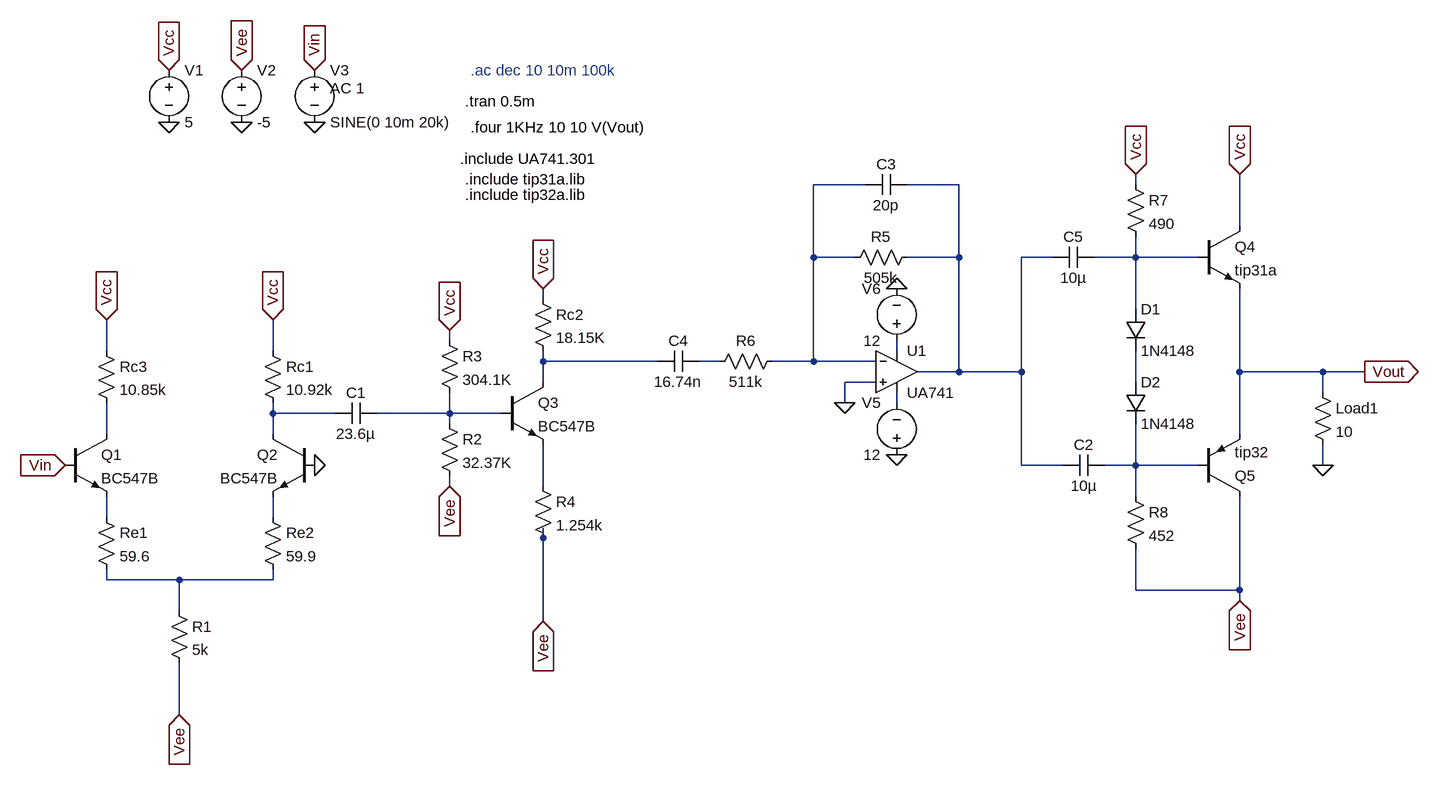
[diagram p0: schematic hardware_sim.asc]
hardware_sim.asc, the LTspice schematic file:
Version 4
SHEET 1 1568 872
WIRE 688 -64 608 -64
WIRE 832 -64 752 -64
WIRE 1104 -64 1104 -80
WIRE 1264 0 1264 -80
WIRE 608 48 608 -64
WIRE 672 48 608 48
WIRE 832 48 832 -64
WIRE 832 48 752 48
WIRE 976 48 928 48
WIRE 1104 48 1104 16
WIRE 1104 48 1040 48
WIRE 1200 48 1104 48
WIRE 192 112 192 96
WIRE 1104 128 1104 48
WIRE 48 176 48 160
WIRE -480 192 -480 144
WIRE -224 192 -224 144
WIRE 736 192 736 176
WIRE 192 208 192 192
WIRE 368 208 192 208
WIRE 464 208 432 208
WIRE 608 208 608 48
WIRE 608 208 544 208
WIRE 704 208 608 208
WIRE 832 224 832 48
WIRE 832 224 768 224
WIRE 928 224 928 48
WIRE 928 224 832 224
WIRE 1264 224 1264 96
WIRE 1392 224 1264 224
WIRE 1456 224 1392 224
WIRE 192 240 192 208
WIRE 704 240 656 240
WIRE 1104 240 1104 192
WIRE 1392 256 1392 224
WIRE 656 272 656 240
WIRE 736 272 736 256
WIRE -224 288 -224 272
WIRE -128 288 -224 288
WIRE 48 288 48 256
WIRE 48 288 -64 288
WIRE 128 288 48 288
WIRE 48 304 48 288
WIRE -480 320 -480 272
WIRE -224 320 -224 288
WIRE 1264 320 1264 224
WIRE 928 368 928 224
WIRE 992 368 928 368
WIRE 1104 368 1104 304
WIRE 1104 368 1056 368
WIRE 1200 368 1104 368
WIRE 1392 368 1392 336
WIRE 48 400 48 384
WIRE 192 400 192 336
WIRE 1104 416 1104 368
WIRE -480 448 -480 416
WIRE -224 448 -224 416
WIRE 192 480 192 464
WIRE -480 544 -480 528
WIRE -368 544 -480 544
WIRE -224 544 -224 528
WIRE -224 544 -368 544
WIRE 1104 560 1104 496
WIRE 1264 560 1264 416
WIRE 1264 560 1104 560
WIRE 1264 576 1264 560
WIRE -368 592 -368 544
WIRE 192 608 192 480
WIRE -368 752 -368 672
FLAG -384 -160 0
FLAG -272 -160 0
FLAG -384 -240 Vcc
IOPIN -384 -240 In
FLAG -272 -240 Vee
IOPIN -272 -240 In
FLAG -368 752 Vee
IOPIN -368 752 In
FLAG -224 144 Vcc
IOPIN -224 144 In
FLAG -480 144 Vcc
IOPIN -480 144 In
FLAG -160 -160 0
FLAG -160 -240 Vin
IOPIN -160 -240 In
FLAG -544 368 Vin
IOPIN -544 368 In
FLAG -160 368 0
FLAG 48 160 Vcc
IOPIN 48 160 In
FLAG 192 96 Vcc
IOPIN 192 96 In
FLAG 48 400 Vee
IOPIN 48 400 In
FLAG 192 608 Vee
IOPIN 192 608 In
FLAG 656 272 0
FLAG 736 352 0
FLAG 736 96 0
FLAG 1456 224 Vout
IOPIN 1456 224 Out
FLAG 1264 -80 Vcc
IOPIN 1264 -80 In
FLAG 1104 -80 Vcc
IOPIN 1104 -80 In
FLAG 1392 368 0
FLAG 1264 576 Vee
IOPIN 1264 576 In
DATAFLAG -224 288 ""
DATAFLAG -368 544 ""
DATAFLAG 1120 48 ""
DATAFLAG 1120 368 ""
DATAFLAG 1264 224 ""
SYMBOL npn -544 320 R0
SYMATTR InstName Q1
SYMATTR Value BC547B
SYMBOL npn -160 320 M0
SYMATTR InstName Q2
SYMATTR Value BC547B
SYMBOL voltage -384 -256 R0
WINDOW 123 0 0 Left 0
WINDOW 39 0 0 Left 0
SYMATTR InstName V1
SYMATTR Value 5
SYMBOL voltage -272 -256 R0
WINDOW 123 0 0 Left 0
WINDOW 39 0 0 Left 0
SYMATTR InstName V2
SYMATTR Value -5
SYMBOL res -384 576 R0
SYMATTR InstName R1
SYMATTR Value 5k
SYMBOL res -240 176 R0
SYMATTR InstName Rc1
SYMATTR Value 10.92k
SYMBOL cap -64 272 R90
WINDOW 0 0 32 VBottom 2
WINDOW 3 32 32 VTop 2
SYMATTR InstName C1
SYMATTR Value 23.6µ
SYMBOL voltage -160 -256 R0
WINDOW 123 24 44 Left 2
WINDOW 39 0 0 Left 0
SYMATTR Value2 AC 1
SYMATTR InstName V3
SYMATTR Value SINE(0 10m 20k)
SYMBOL res -496 176 R0
SYMATTR InstName Rc3
SYMATTR Value 10.85k
SYMBOL res -496 432 R0
SYMATTR InstName Re1
SYMATTR Value 59.6
SYMBOL res -240 432 R0
SYMATTR InstName Re2
SYMATTR Value 59.9
SYMBOL res 32 288 R0
SYMATTR InstName R2
SYMATTR Value 32.37K
SYMBOL res 32 160 R0
SYMATTR InstName R3
SYMATTR Value 304.1K
SYMBOL res 176 96 R0
SYMATTR InstName Rc2
SYMATTR Value 18.15K
SYMBOL npn 128 240 R0
SYMATTR InstName Q3
SYMATTR Value BC547B
SYMBOL res 176 384 R0
SYMATTR InstName R4
SYMATTR Value 1.254k
SYMBOL OpAmps\\opamp2 736 160 R0
SYMATTR InstName U1
SYMATTR Value UA741
SYMBOL cap 752 -80 R90
WINDOW 0 0 32 VBottom 2
WINDOW 3 32 32 VTop 2
SYMATTR InstName C3
SYMATTR Value 20p
SYMBOL res 768 32 R90
WINDOW 0 0 56 VBottom 2
WINDOW 3 32 56 VTop 2
SYMATTR InstName R5
SYMATTR Value 505k
SYMBOL res 560 192 R90
WINDOW 0 0 56 VBottom 2
WINDOW 3 32 56 VTop 2
SYMATTR InstName R6
SYMATTR Value 511k
SYMBOL cap 432 192 R90
WINDOW 0 0 32 VBottom 2
WINDOW 3 32 32 VTop 2
SYMATTR InstName C4
SYMATTR Value 16.74n
SYMBOL voltage 736 368 R180
WINDOW 0 24 96 Left 2
WINDOW 3 24 16 Left 2
WINDOW 123 0 0 Left 0
WINDOW 39 0 0 Left 0
SYMATTR InstName V5
SYMATTR Value 12
SYMBOL voltage 736 192 R180
WINDOW 0 24 96 Left 2
WINDOW 3 24 16 Left 2
WINDOW 123 0 0 Left 0
WINDOW 39 0 0 Left 0
SYMATTR InstName V6
SYMATTR Value 12
SYMBOL diode 1088 128 R0
SYMATTR InstName D1
SYMATTR Value 1N4148
SYMBOL diode 1088 240 R0
SYMATTR InstName D2
SYMATTR Value 1N4148
SYMBOL res 1088 -80 R0
SYMATTR InstName R7
SYMATTR Value 490
SYMBOL res 1088 400 R0
SYMATTR InstName R8
SYMATTR Value 452
SYMBOL res 1376 240 R0
SYMATTR InstName Load1
SYMATTR Value 10
SYMBOL cap 1056 352 R90
WINDOW 0 0 32 VBottom 2
WINDOW 3 32 32 VTop 2
SYMATTR InstName C2
SYMATTR Value 10µ
SYMBOL cap 1040 32 R90
WINDOW 0 0 32 VBottom 2
WINDOW 3 32 32 VTop 2
SYMATTR InstName C5
SYMATTR Value 10µ
SYMBOL npn 1200 0 R0
SYMATTR InstName Q4
SYMATTR Value tip31a
SYMBOL pnp 1200 416 M180
SYMATTR InstName Q5
SYMATTR Value tip32
TEXT 64 -104 Left 2 !.include UA741.301
TEXT 80 -152 Left 2 !.four 1KHz 10 10 V(Vout)
TEXT 72 -192 Left 2 !.tran 0.5m
TEXT 72 -72 Left 2 !.include tip31a.lib
TEXT 72 -48 Left 2 !.include tip32a.lib
TEXT 80 -240 Left 2 ;.ac dec 10 10m 100k

The netlist it stands for:
* hardware_sim.asc
Q1 N011 Vin N014 0 BC547B
Q2 N009 0 N015 0 BC547B
V1 Vcc 0 5
V2 Vee 0 -5
R1 N016 Vee 5k
Rc1 Vcc N009 10.92k
C1 N010 N009 23.6µ
V3 Vin 0 SINE(0 10m 20k) AC 1
Rc3 Vcc N011 10.85k
Re1 N014 N016 59.6
Re2 N015 N016 59.9
R2 N010 Vee 32.37K
R3 Vcc N010 304.1K
Rc2 Vcc N005 18.15K
Q3 N005 N010 N013 0 BC547B
R4 N013 Vee 1.254k
XU1 0 N001 N004 N008 N002 UA741  ; pins In+ In- V+ V- OUT
C3 N002 N001 20p
R5 N002 N001 505k
R6 N001 N006 511k
C4 N006 N005 16.74n
V5 0 N008 12
V6 N004 0 12
D1 N003 N007 1N4148
D2 N007 N012 1N4148
R7 Vcc N003 490
R8 N012 Vee 452
R§Load1 Vout 0 10
C2 N012 N002 10µ
C5 N003 N002 10µ
Q4 Vcc N003 Vout 0 tip31a
Q5 Vee N012 Vout 0 tip32
.model D D
.lib standard.dio
.model NPN NPN
.model PNP PNP
.lib standard.bjt
.include UA741.301
.four 1KHz 10 10 V(Vout)
.tran 0.5m
.include tip31a.lib
.include tip32a.lib
* .ac dec 10 10m 100k
.backanno
.end